# EAGLE schematic ruido_v5_main (EAGLE 5.10)
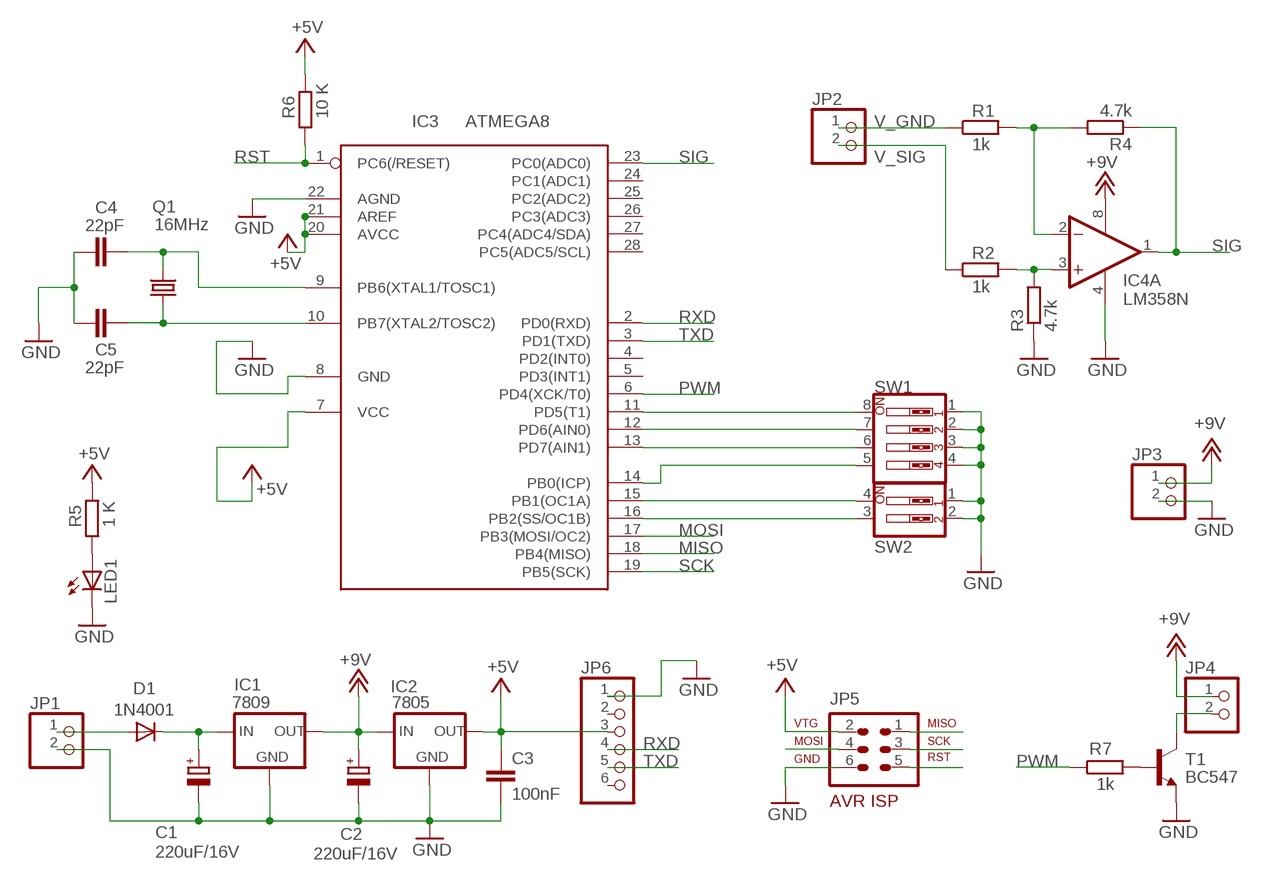
[diagram p0: schematic, sheet 1]

## Parts
C1  220uF/16V  CPOL-EUE2.5-6  [E2,5-6]
C2  220uF/16V  CPOL-EUE2.5-6  [E2,5-6]
C3  100nF  C-EU050-045X075  [C050-045X075]
C4  22pF  C-EU025-025X050  [C025-025X050]
C5  22pF  C-EU025-025X050  [C025-025X050]
D1  1N4001  1N4004A  [DO41-7]
IC1  7809  78XXSB  [78XXH]
IC2  7805  78XXSB  [78XXH]
IC3  ATMEGA8  MEGA8-P  [DIL28-3]
IC4  LM358N  [DIL08]
JP1  PINHD-1X2  [1X02]
JP2  PINHD-1X2  [1X02]
JP3  PINHD-1X2  [1X02]
JP4  PINHD-1X2  [1X02]
JP5  AVR-ISP-6  [AVR-ISP-6]
JP6  PINHD-1X6  [1X06]
LED1  LED3MM  [LED3MM]
Q1  16MHz  CRYSTALHC49S  [HC49/S]
R1  1k  R-EU_  [0207/7]
R2  1k  R-EU_  [0207/7]
R3  4.7k  R-EU_  [0207/7]
R4  4.7k  R-EU_  [0207/7]
R5  1 K  R-EU_  [0207/7]
R6  10 K  R-EU_  [0207/7]
R7  1k  R-EU_  [0207/7]
SW1  SW_DIP-4  [EDG-04]
SW2  SW_DIP-2  [EDG-02]
T1  BC547  BC547-  [TO92-]

## Nets
+5V: C3.1 IC2.OUT IC3.7(VCC) IC3.20(AVCC) IC3.21(AREF) JP5.2(VTG) JP6.3 R5.2 R6.2
+12V: C2.+ IC1.OUT IC2.IN IC4.8(P:V+) JP3.1 JP4.1 ; supply symbol labelled +9V
GND: C1.- C2.- C3.2 C4.1 C5.1 IC1.GND IC2.GND IC3.8(GND) IC3.22(AGND) IC4.4(P:V-) JP1.2 JP3.2 JP5.6(GND) JP6.1 LED1.K(C) R3.1 SW1.1 SW1.2 SW1.3 SW1.4 SW2.1 SW2.2 T1.1(E)
MISO: IC3.18(PB4(MISO)) JP5.1(MISO)
MOSI: IC3.17(PB3(MOSI/OC2)) JP5.4(MOSI)
N$1: C1.+ D1.C IC1.IN
N$2: JP4.2 T1.3(C)
N$3: IC4.3(A:+IN) R2.2 R3.2
N$4: IC4.2(A:-IN) R1.2 R4.2
N$5: IC3.15(PB1(OC1A)) SW2.4
N$6: IC3.16(PB2(SS/OC1B)) SW2.3
N$11: R7.2 T1.2(B)
N$15: IC3.14(PB0(ICP)) SW1.5
N$18: C4.2 IC3.9(PB6(XTAL1/TOSC1)) Q1.2
N$19: C5.2 IC3.10(PB7(XTAL2/TOSC2)) Q1.1
N$22: IC3.13(PD7(AIN1)) SW1.6
N$23: IC3.12(PD6(AIN0)) SW1.7
N$24: IC3.11(PD5(T1)) SW1.8
N$30: LED1.A R5.1
N$37: D1.A JP1.1
PWM: IC3.6(PD4(XCK/T0)) R7.1
RST: IC3.1(PC6(/RESET)) JP5.5(RST) R6.1
RXD: IC3.2(PD0(RXD)) JP6.4
SCK: IC3.19(PB5(SCK)) JP5.3(SCK)
SIG: IC3.23(PC0(ADC0)) IC4.1(A:OUT) R4.1
TXD: IC3.3(PD1(TXD)) JP6.5
V_GND: JP2.1 R1.1
V_SIG: JP2.2 R2.1
Unconnected: IC3.4(PD2(INT0)) IC3.5(PD3(INT1)) IC3.24(PC1(ADC1)) IC3.25(PC2(ADC2)) IC3.26(PC3(ADC3)) IC3.27(PC4(ADC4/SDA)) IC3.28(PC5(ADC5/SCL)) IC4.5(B:+IN) IC4.6(B:-IN) IC4.7(B:OUT) JP6.2 JP6.6

## Library data of the parts
C1 C2 = ruido:CPOL-EU: POLARIZED CAPACITOR, European symbol
C3-C5 = ruido:C-EU: CAPACITOR, European symbol
D1 = ruido:1N4004: DIODE general purpose rectifier, 1 A
IC1 IC2 = ruido:78XXS: VOLTAGE REGULATOR
IC3 = ruido:MEGA8-P: MICROCONTROLLER 8 Kbytes FLASH 1 kbytes SRAM 512 bytes EEPROM USART 4-channel 10 bit ADC 2-channel 8 bit ADC Source: avr.lbr
IC4 = ruido:LM358: OP AMP also LM158; LM258; LM2904 Source: http://cache.national.com/ds/LM/LM158.pdf
JP1-JP4 = ruido:PINHD-1X2: PIN HEADER
JP5 = ruido:AVR-ISP-6: AVR ISP-6 Serial Programming Header
JP6 = ruido:PINHD-1X6: PIN HEADER
LED1 = ruido:LED: LED OSRAM: - CHIPLED LG R971, LG N971, LY N971, LG Q971, LY Q971, LO R971, LY R971 LH N974, LH R974 LS Q976, LO Q976, LY Q976 LO Q996 - Hyper CHIPLED LW Q18S LB Q993, LB Q99A, LB R99A - SideLED LS A670, LO A670, LY A670, LG A670, LP A670 LB A673, LV A673, LT A673, LW A673 LH A674 LY A675 LS A676, LA A676, LO A676, LY A676, LW A676 LS A679, LY A679, LG A679 - Hyper Micro SIDELED® LS Y876, LA Y876, LO Y876, LY Y876 LT Y87S - SmartLED LW L88C, LW L88S LB L89C, LB L89S, LG L890 LS L89K, LO L89K, LY L89K LS L896, LA L896, LO L896, LY L896 - TOPLED LS T670, LO T670, LY T670, LG T670, LP T670 LSG T670, LSP T670, LSY T670, LOP T670, LYG T670 LG T671, LOG T671, LSG T671 LB T673, LV T673, LT T673, LW T673 LH T674 LS T676, LA T676, LO T676, LY T676, LB T676, LH T676, LSB T676, LW T676 LB T67C, LV T67C, LT T67C, LS T67K, LO T67K, LY T67K, LW E67C LS E67B, LA E67B, LO E67B, LY E67B, LB E67C, LV E67C, LT E67C LW T67C LS T679, LY T679, LG T679 LS T770, LO T770, LY T770, LG T770, LP T770 LB T773, LV T773, LT T773, LW T773 LH T774 LS E675, LA E675, LY E675, LS T675 LS T776, LA T776, LO T776, LY T776, LB T776 LHGB T686 LT T68C, LB T68C - Hyper Mini TOPLED® LB M676 - Mini TOPLED Santana® LG M470 LS M47K, LO M47K, LY M47K Source: http://www.osram.convergy.de - LUMILED® LXK2-PW12-R00, LXK2-PW12-S00, LXK2-PW14-U00, LXK2-PW14-V00 LXK2-PM12-R00, LXK2-PM12-S00, LXK2-PM14-U00 LXK2-PE12-Q00, LXK2-PE12-R00, LXK2-PE12-S00, LXK2-PE14-T00, LXK2-PE14-U00 LXK2-PB12-K00, LXK2-PB12-L00, LXK2-PB12-M00, LXK2-PB14-N00, LXK2-PB14-P00, LXK2-PB14-Q00 LXK2-PR12-L00, LXK2-PR12-M00, LXK2-PR14-Q00, LXK2-PR14-R00 LXK2-PD12-Q00, LXK2-PD12-R00, LXK2-PD12-S00 LXK2-PH12-R00, LXK2-PH12-S00 LXK2-PL12-P00, LXK2-PL12-Q00, LXK2-PL12-R00 Source: www.luxeon.com
Q1 = ruido:CRYSTAL: CRYSTAL
R1-R7 = ruido:R-EU_: RESISTOR, European symbol
SW1 = ruido:SW_DIP-4: DIP SWITCH
SW2 = ruido:SW_DIP-2: DIP SWITCH
T1 = ruido:BC547: NPN TRANSISTOR